# EAGLE design pms (EAGLE 9.6.2)
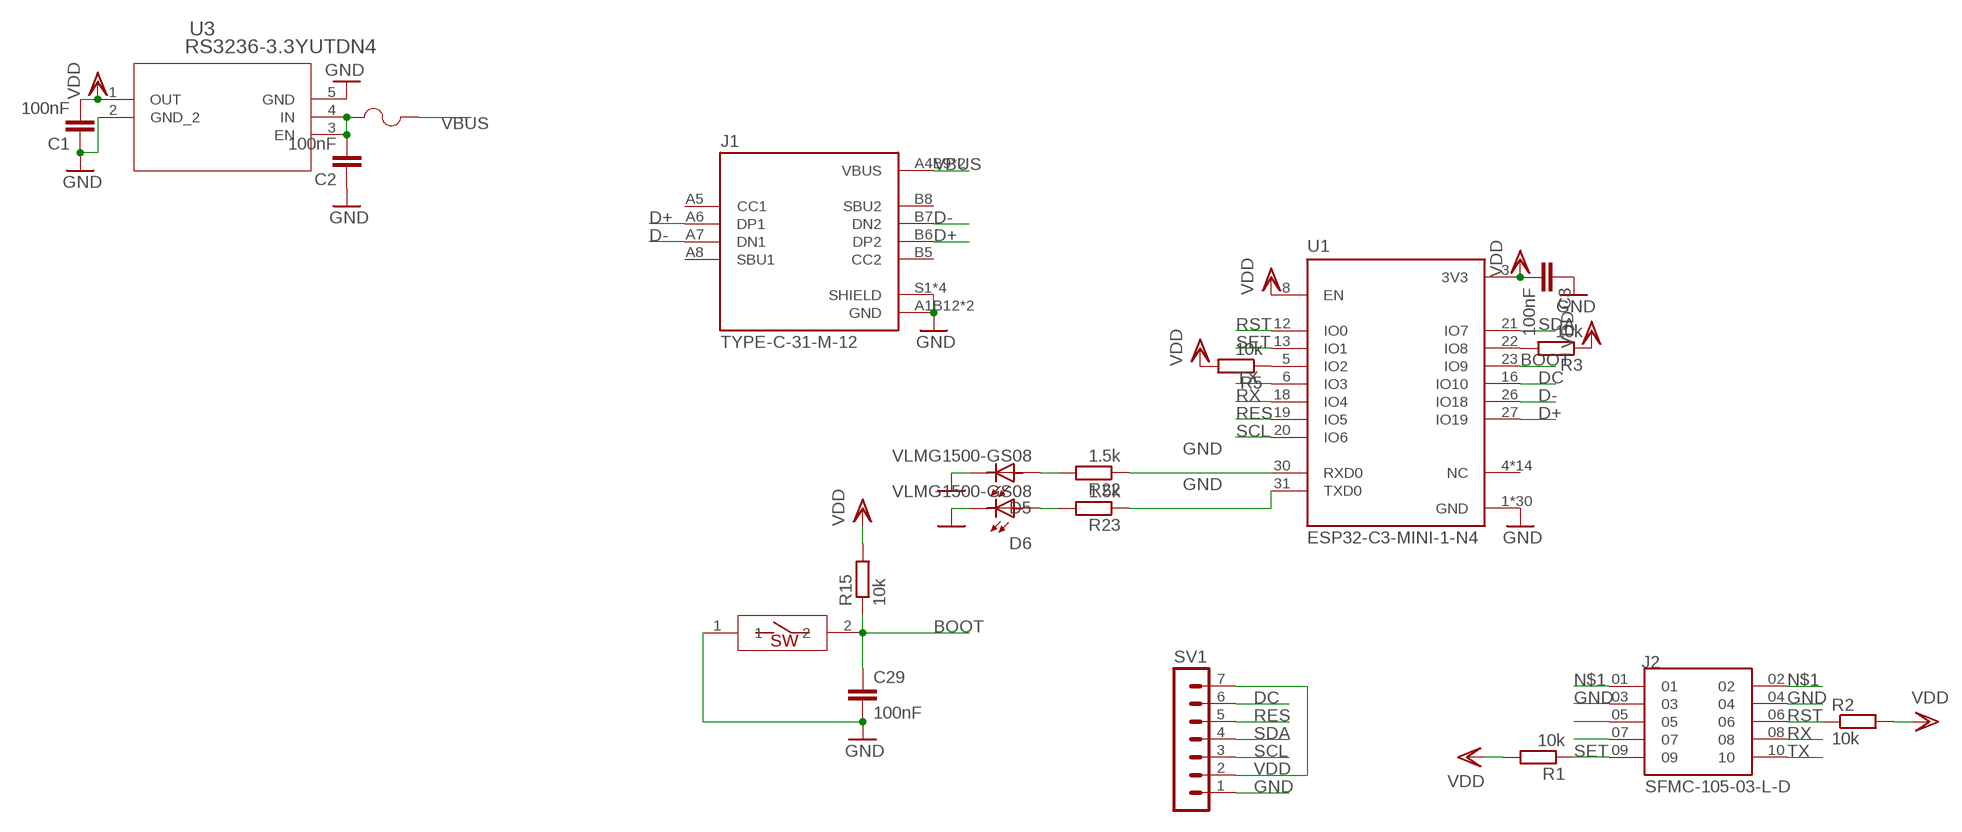
[diagram p0: schematic, sheet 1]

## Parts
C1  100nF  CC0402  [C0402]
C2  100nF  CC0402  [C0402]
C3  100nF  CC0402  [C0402]
C29  100nF  CC0402  [C0402]
D5  VLMG1500-GS08  [LEDC1005X35N]
D6  VLMG1500-GS08  [LEDC1005X35N]
F2  1210L050YR1210LSERIES_LTF-L  [1210LSERIES_LTF-L]
J1  TYPE-C-31-M-12  [HRO_TYPE-C-31-M-12]
J2  SFMC-105-03-L-D  [SAMTEC_SFMC-105-03-L-D]
R1  10k  RR0402  [R0402]
R2  10k  RR0402  [R0402]
R3  10k  RR0402  [R0402]
R5  10k  RR0402  [R0402]
R15  10k  RR0402  [R0402]
R22  1.5k  RR0402  [R0402]
R23  1.5k  RR0402  [R0402]
RESET  SMDSWITCH  [RESC4217X170]
SV1  MA07-1  [MA07-1]
U1  ESP32-C3-MINI-1-N4  [XCVR_ESP32-C3-MINI-1-N4]
U3  RS3236-3.3YUTDN4  [UTDFN-1X1-4_JRT]

## Nets
BOOT: C29.1 R15.1 RESET.2 U1.23(IO9)
D+: J1.A6(DP1) J1.B6(DP2) U1.27(IO19)
D-: J1.A7(DN1) J1.B7(DN2) U1.26(IO18)
DC: SV1.6 U1.16(IO10)
GND: C1.1 C2.1 C3.1 C29.2 D5.2 D6.2 J1.A1B12(GND) J1.B1A12(GND) J1.S1(SHIELD) J1.S2(SHIELD) J1.S3(SHIELD) J1.S4(SHIELD) J2.03 J2.04 RESET.1 SV1.1 U1.1(GND) U1.2(GND) U1.11(GND) U1.14(GND) U1.36(GND) U1.37(GND) U1.38(GND) U1.39(GND) U1.40(GND) U1.41(GND) U1.42(GND) U1.43(GND) U1.44(GND) U1.45(GND) U1.46(GND) U1.47(GND) U1.48(GND) U1.49_1(GND) U1.49_2(GND) U1.49_3(GND) U1.49_4(GND) U1.49_5(GND) U1.49_6(GND) U1.49_7(GND) U1.49_8(GND) U1.49_9(GND) U1.50(GND) U1.51(GND) U1.52(GND) U1.53(GND) U3.2(GND_2) U3.5(GND)
N$1: C2.2 F2.2 J2.01 J2.02 U3.3(EN) U3.4(IN)
N$2: R3.2 U1.22(IO8)
N$3: R5.1 U1.5(IO2)
N$4: R23.1 U1.31(TXD0)
N$5: J2.07
N$6: J2.05
N$7: R22.1 U1.30(RXD0)
N$21: D5.1 R22.2
N$25: D6.1 R23.2
RES: SV1.5 U1.19(IO5)
RST: J2.06 R2.1 U1.12(IO0)
RX: J2.08 U1.18(IO4)
SCL: SV1.3 U1.20(IO6)
SDA: SV1.4 U1.21(IO7)
SET: J2.09 R1.1 U1.13(IO1)
TX: J2.10 U1.6(IO3)
VBUS: F2.1 J1.A4B9(VBUS) J1.B4A9(VBUS)
VDD: C1.2 C3.2 R1.2 R2.2 R3.1 R5.2 R15.2 SV1.2 SV1.7 U1.3(3V3) U1.8(EN) U3.1(OUT)
Unconnected: J1.A5(CC1) J1.A8(SBU1) J1.B5(CC2) J1.B8(SBU2) U1.4(NC) U1.7(NC) U1.9(NC) U1.10(NC) U1.15(NC) U1.17(NC) U1.24(NC) U1.25(NC) U1.28(NC) U1.29(NC) U1.32(NC) U1.33(NC) U1.34(NC) U1.35(NC)

## Library data of the parts
C1-C3 C29 = eagle-ltspice:C: CAPACITOR, European symbol; SPICEMODEL: NONE; SPICEPREFIX: C
D5 D6 = VLMG1500-GS08:VLMG1500-GS08: 0402 GREEN 571nm 35MCD 65° Rectangle with Flat Top SMT LED; AVAILABILITY: Unavailable; DESCRIPTION: 0402 GREEN 571nm 35MCD 65° Rectangle with Flat Top SMT LED; MF: Vishay; MP: VLMG1500-GS08; PACKAGE: 0402 Vishay; PRICE: None
F2 = 1210 FUSE:1210L050YR; BUILT_BY: EMA_UL_Team; MANUFACTURER_PART_NUMBER: 1210L050YR; SOURCELIBRARY: LittleFuse_2015-04-13; VENDOR: Littelfuse Inc
J1 = TYPE-C-31-M-12:TYPE-C-31-M-12: USB Connectors 24 Receptacle 1 8.94*7.3mm RoHS Check prices <https://pricing.snapeda.com/parts/TYPE-C-31-M-12/HRO%20Electronics%20Co.%2C%20Ltd./view-part?ref=eda>; AVAILABILITY: Not in stock; DESCRIPTION: USB Connectors 24 Receptacle 1 8.94*7.3mm RoHS; MF: HRO Electronics Co., Ltd.; MP: TYPE-C-31-M-12; PACKAGE: Package; PRICE: None
J2 = SFMC-105-03-L-D:SFMC-105-03-L-D: Check availability <https://pricing.snapeda.com/parts/SFMC-105-03-L-D/Samtec/view-part?ref=eda>; AVAILABILITY: In Stock; DESCRIPTION: Conn Socket Strip SKT 10 POS 1.27mm Solder ST Thru-Hole Tube; MF: Samtec; MP: SFMC-105-03-L-D; PACKAGE: None; PRICE: None; PURCHASE-URL: https://pricing.snapeda.com/search/part/SFMC-105-03-L-D/?ref=eda
R1-R3 R5 R15 R22 R23 = eagle-ltspice:R: RESISTOR, European symbol; SPICEMODEL: NONE; SPICEPREFIX: R
RESET = SMD SWITCH:SMDSWITCH
SV1 = con-lstb:MA07-1: PIN HEADER; OC_FARNELL: unknown; OC_NEWARK: unknown
U1 = ESP32-C3-MINI-1-N4:ESP32-C3-MINI-1-N4: Check availability <https://pricing.snapeda.com/parts/ESP32-C3-MINI-1-N4/Espressif%20Systems/view-part?ref=eda>; AVAILABILITY: In Stock; DESCRIPTION: Bluetooth, WiFi 802.11b/g/n, Bluetooth v5.0 Transceiver Module 2.412GHz ~ 2.484GHz PCB Trace Surface Mount; MF: Espressif Systems; MP: ESP32-C3-MINI-1-N4; PACKAGE: SMD-53 Espressif Systems; PRICE: None; PURCHASE-URL: https://pricing.snapeda.com/search/part/ESP32-C3-MINI-1-N4/?ref=eda
U3 = RS3236:RS3236-3.3YUTDN4; COPYRIGHT: Copyright (C) 2022 Ultra Librarian. All rights reserved.; MANUFACTURER_PART_NUMBER: RS3236-3.3YUTDN4; MFR_NAME: RUNIC Technology

## Net classes
2 NCLS3V7: width 0.178 mm, drill 0.178 mm, clearance 0.178 mm

## Board
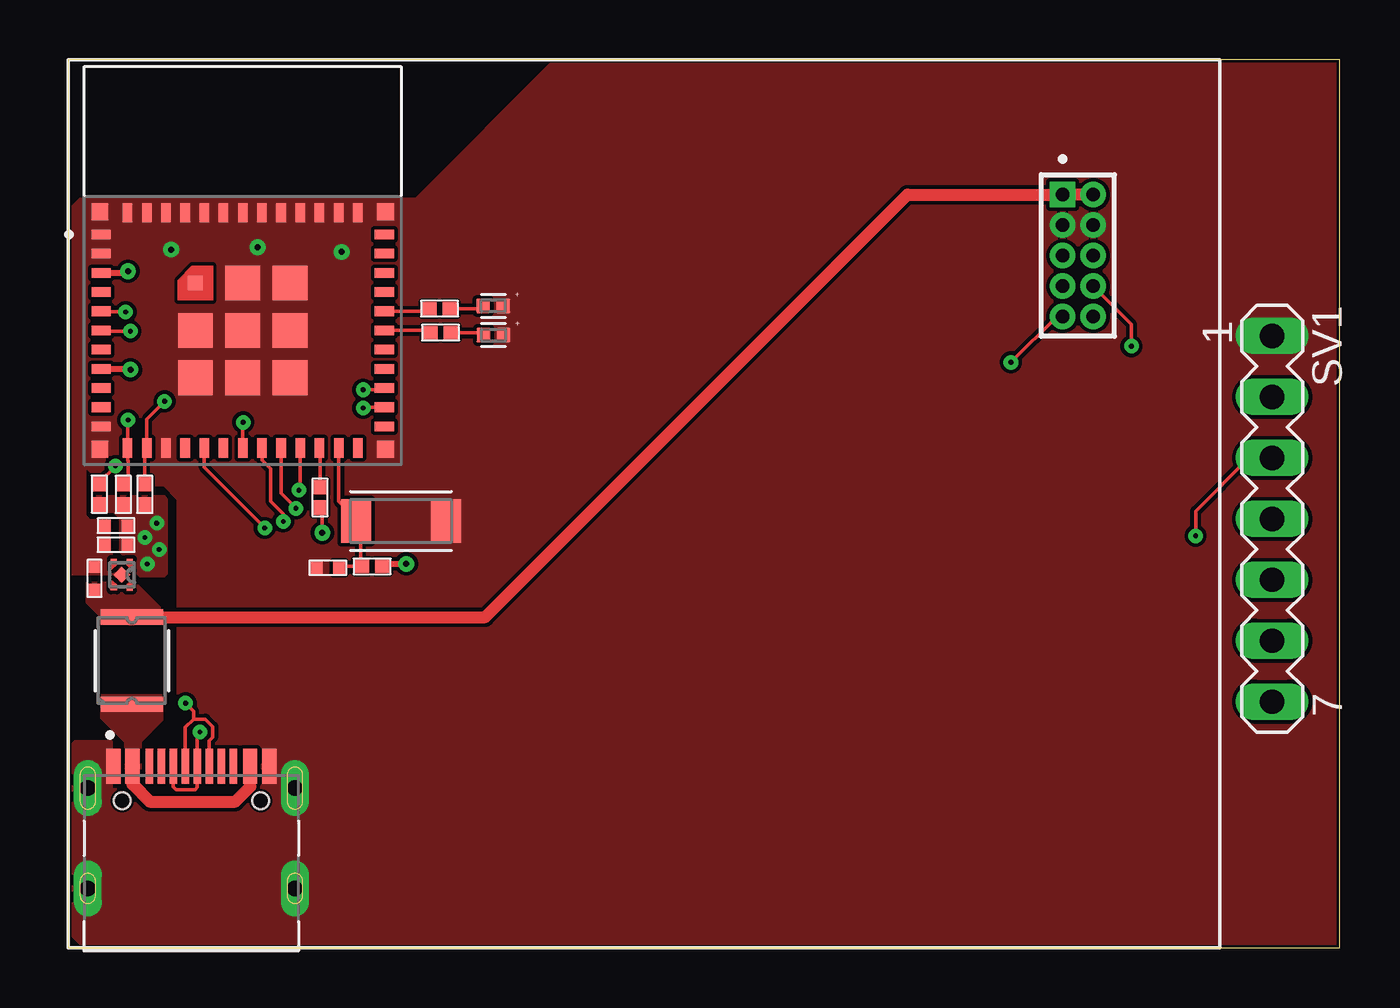
[diagram p1: board, top side]
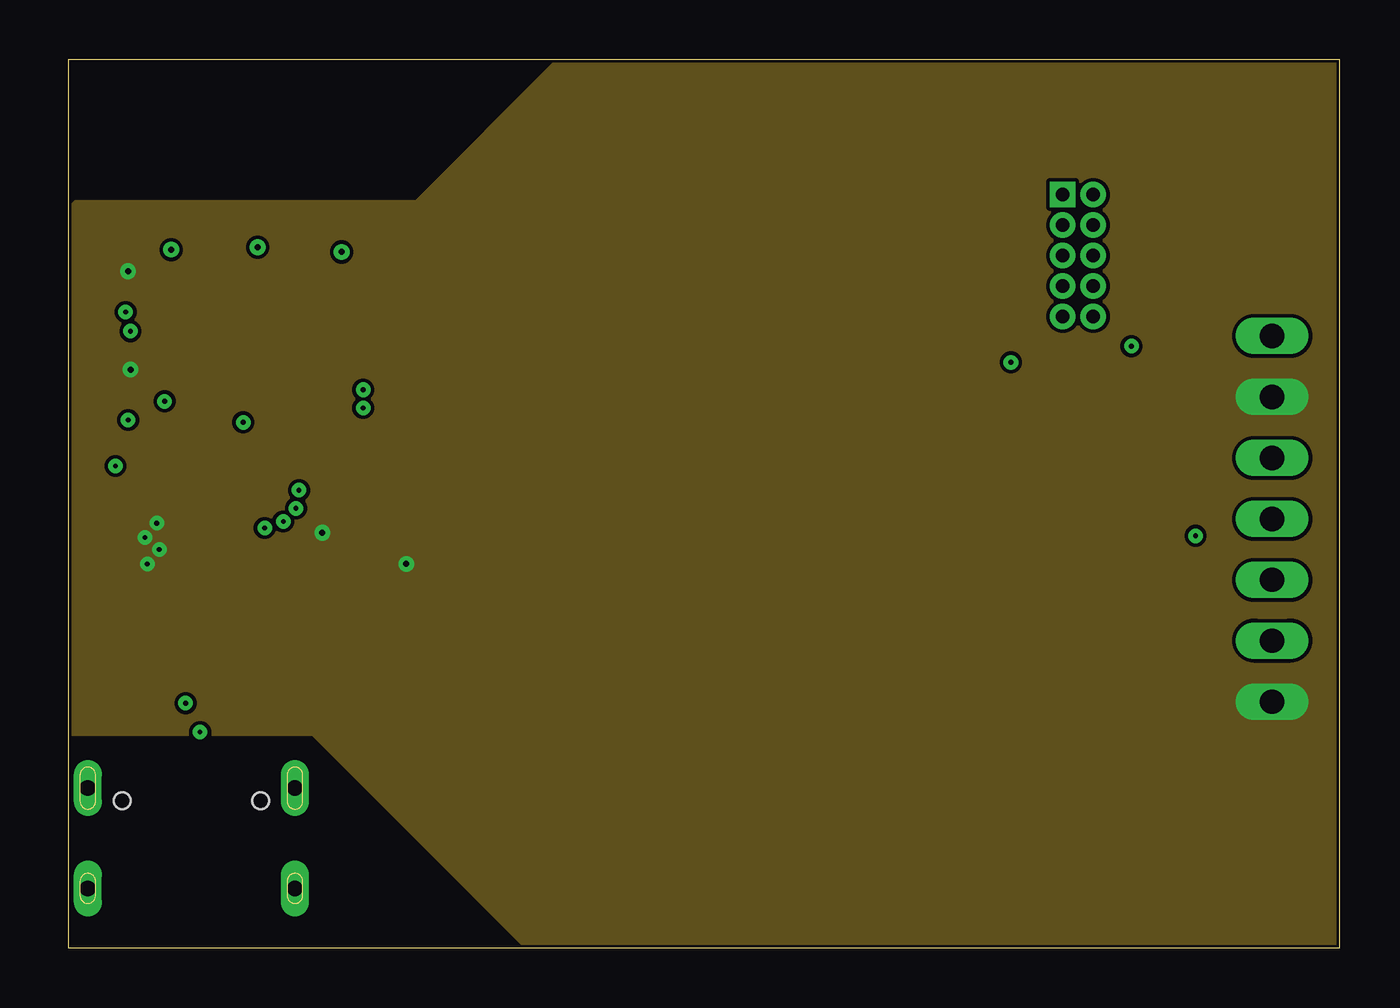
[diagram p2: board, inner layer Route15]
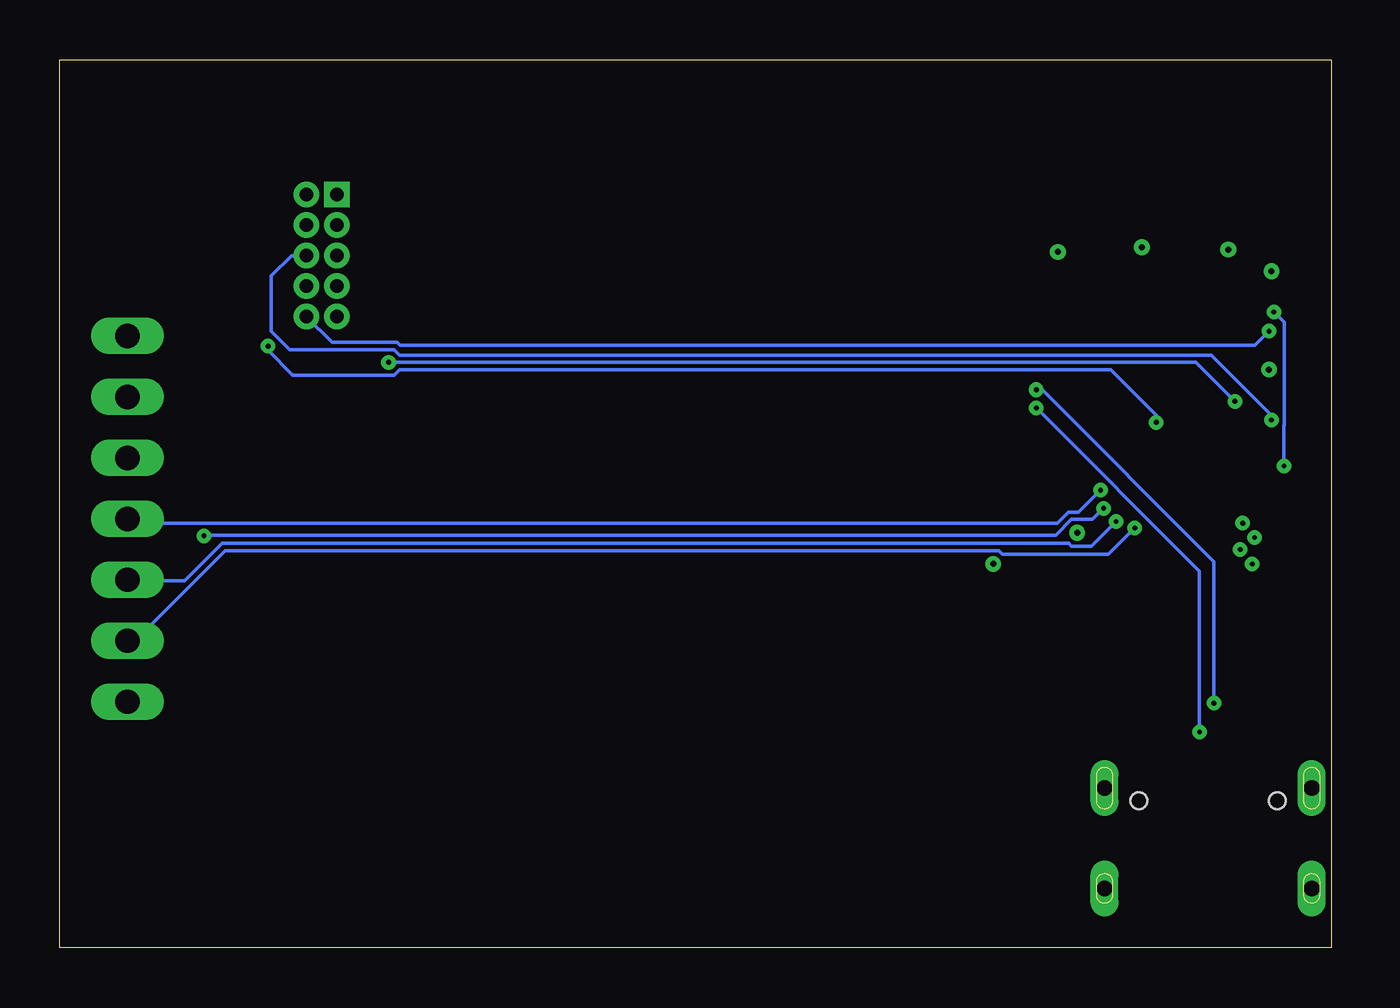
[diagram p3: board, bottom side, seen from below]

Size 53 x 37 mm. Coordinates in mm from the lower left corner, seen from the top.
Outline: 0,0 53,0 53,37 0,37 0,0
Copper layers (1+2*15+16): Top 0.035mm / dielectric 1.5mm / Route2 0.035mm / dielectric 0.15mm / Route15 0.035mm / dielectric 0.2mm / Bottom 0.035mm
Design rules "default *": minimum track width 5mil, minimum drill 0.2mm, track to track 6mil, track to pad 6mil, pad to pad 6mil, via to via 6mil, smd to smd 6mil, copper to edge 5mil, drill to drill 6mil, minimum pad ring 10mil, minimum via ring 8mil, stop-mask expansion 0mil, vias tented up to drill 40mil, thermal gap 0mil

### Footprints (pad centres in the part's own frame; a part is rotated, then mirrored left to right if it is on the bottom)
C0402 = smd 0.5 x 0.5: 1 -0.475,0; 2 0.475,0
LEDC1005X35N = smd 0.59 x 0.61: 1 -0.415,0; 2 0.415,0
1210LSERIES_LTF-L = smd 0.635 x 2.591: 1 -1.816,0; 2 1.816,0
HRO_TYPE-C-31-M-12 = smd 0.6 x 1.45: A1B12 -3.25,5.095; A4B9 -2.45,5.095; B1A12 3.25,5.095; B4A9 2.45,5.095 | smd 0.3 x 1.45: A5 -1.25,5.095; A6 -0.25,5.095; A7 0.25,5.095; A8 1.25,5.095; B5 1.75,5.095; B6 0.75,5.095; B7 -0.75,5.095; B8 -1.75,5.095 | drill 0.65 pad 1.05 long: S1 -4.32,4.18; S2 4.32,4.18; S3 -4.32,0; S4 4.32,0 | hole 0.7: -2.89,3.65; 2.89,3.65
SAMTEC_SFMC-105-03-L-D = drill 0.559 pad 0.889 square: 01 0,0 | drill 0.559 pad 0.889: 02 0,1.27; 03 1.27,0; 04 1.27,1.27; 05 2.54,0; 06 2.54,1.27; 07 3.81,0; 08 3.81,1.27; 09 5.08,0; 10 5.08,1.27
R0402 = smd 0.6 x 0.55: 1 -0.425,0; 2 0.425,0
RESC4217X170 = smd 1.254 x 1.829: 1 -1.875,0; 2 1.875,0
MA07-1 = drill 1.016 long: 1 -7.62,0; 2 -5.08,0; 3 -2.54,0; 4 0,0; 5 2.54,0; 6 5.08,0; 7 7.62,0
XCVR_ESP32-C3-MINI-1-N4 = smd 0.8 x 0.4: 1 -5.9,1.3; 2 -5.9,0.5; 3 -5.9,-0.3; 4 -5.9,-1.1; 5 -5.9,-1.9; 6 -5.9,-2.7; 7 -5.9,-3.5; 8 -5.9,-4.3; 9 -5.9,-5.1; 10 -5.9,-5.9; 11 -5.9,-6.7; 25 5.9,-6.7; 26 5.9,-5.9; 27 5.9,-5.1; 28 5.9,-4.3; 29 5.9,-3.5; 30 5.9,-2.7; 31 5.9,-1.9; 32 5.9,-1.1; 33 5.9,-0.3; 34 5.9,0.5; 35 5.9,1.3 | smd 0.4 x 0.8: 12 -4.8,-7.6; 13 -4,-7.6; 14 -3.2,-7.6; 15 -2.4,-7.6; 16 -1.6,-7.6; 17 -0.8,-7.6; 18 0,-7.6; 19 0.8,-7.6; 20 1.6,-7.6; 21 2.4,-7.6; 22 3.2,-7.6; 23 4,-7.6; 24 4.8,-7.6; 36 4.8,2.2; 37 4,2.2; 38 3.2,2.2; 39 2.4,2.2; 40 1.6,2.2; 41 0.8,2.2; 42 0,2.2; 43 -0.8,2.2; 44 -1.6,2.2; 45 -2.4,2.2; 46 -3.2,2.2; 47 -4,2.2; 48 -4.8,2.2 | smd 0.6 x 0.6: 49_1 -1.975,-0.725 | smd 1.45 x 1.45: 49_2 0,-0.725; 49_3 1.975,-0.725; 49_4 1.975,-2.7; 49_5 1.975,-4.675; 49_6 0,-4.675; 49_7 -1.975,-4.675; 49_8 -1.975,-2.7; 49_9 0,-2.7 | smd 0.7 x 0.7: 50 5.95,2.25; 51 5.95,-7.65; 52 -5.95,-7.65; 53 -5.95,2.25
UTDFN-1X1-4_JRT = smd 0.229 x 0.254: 1 -0.54,0.33; 2 -0.54,-0.33; 3 0.54,-0.33; 4 0.54,0.33 | smd 0.483 x 0.483 rotated 45: 5 0,0

### Placement (x,y rotation side)
C1  2,17.6 0 top
C2  1.1,15.4 270 top
C3  2,16.8 0 top
C29  10.83,15.84 180 top
D5  17.73,25.54 0 top
D6  17.72,26.75 0 top
F2  2.66,11.97 90 top
J1  5.14,2.48 0 top
J2  41.46,31.39 270 top
R1  3.2,18.9 270 top
R2  2.3,18.9 270 top
R3  10.5,18.77 90 top
R5  1.3,18.91 270 top
R15  12.67,15.9 0 top
R22  15.53,25.64 0 top
R23  15.49,26.64 0 top
RESET  13.88,17.79 180 top
SV1  50.19,17.88 270 top
U1  7.28,28.43 0 top
U3  2.24,15.55 270 top

### Tracks (layer width: path | path; a pad name or v marks a point on that pad's centre or on a via)
BOOT
  Top 0.15: U1.23 11.28,18.62 11.95,17.95 12.01,17.89 | 12.01,17.89 RESET.2 | C29.1 11.37,15.9 R15.1 12.2,15.95 12.2,17.7 12.01,17.89
D+  (via drill 0.2)
  Top 0.15: J1.A6 4.89,9.19 5.23,9.53 | 5.23,9.53 5.72,9.53 6.03,9.22 6.03,8.78 5.89,8.64 J1.B6 | 5.23,9.53 5.23,9.87 v4.9,10.2 | v12.3,23.26 13.11,23.26 U1.27
  Bottom 0.15: v4.9,10.2 4.9,16.1 12.06,23.26 v12.3,23.26
D-  (via drill 0.2)
  Top 0.15: U1.26 12.33,22.53 v12.3,22.5 | v5.5,9 5.39,8.89 J1.A7 5.39,6.69 5.3,6.6 4.5,6.6 4.39,6.71 J1.B7
  Bottom 0.15: v12.3,22.5 5.5,15.7 v5.5,9
DC  (via drill 0.2)
  Top 0.15: v8.2,17.5 5.68,20.02 U1.16
  Bottom 0.15: SV1.6 49.87,12.8 46.12,16.56 13.87,16.56 13.71,16.4 9.3,16.4 v8.2,17.5
GND  (via drill 0.25)
  other vias: 4.3,29.1 7.9,29.2 11.4,29
  pour Top: 2.2,15.3 1.9,15.6 0,15.6 0,30.7 0.5,31.2 2.6,31.2 2.6,23 0.7,21.1 0.7,18 0.9,17.8 1.7,17.8 1.7,16.6 1.8,16.5 1.8,16.2 2.4,15.6 2.2,15.4
  pour Top: 0.9,31.2 14.5,31.2 20.3,37 53,37 53,0.2 53.1,0.1 0.6,0.1 0.1,0.6 0.1,8.4 0.3,8.6 1.8,8.6 1.8,6.6 4.6,6.6 4.6,18.7 4,19.3 1.5,19.3 0.6,20.2 0.6,30.9
N$1
  Top 0.508: F2.2 17.39,13.79 34.99,31.39 J2.01 J2.02
  pour Top: 1.4,13.5 1.4,13.8 0.8,14.4 0.8,15.2 1.7,15.2 1.9,15.1 2.1,14.9 2.3,14.9 2.7,15.3 3.9,14.1 3.9,13.5
N$2
  Top 0.15: R3.2 10.5,20.81 U1.22
N$3  (via drill 0.2)
  Top 0.15: R5.1 1.3,19.41 v1.98,20.08 | v2.4,26.5 1.41,26.5 U1.5
  Bottom 0.15: v1.98,20.08 1.98,21.77 1.97,21.78 1.97,26.07 v2.4,26.5
N$4
  Top 0.15: U1.31 14.96,26.53 R23.1
N$7
  Top 0.15: U1.30 15.02,25.73 R22.1
N$21
  Top 0.15: R22.2 17.21,25.64 D5.1
N$25
  Top 0.15: R23.2 17.2,26.64 D6.1
RES  (via drill 0.2)
  Top 0.15: U1.19 8.08,20.33 8.45,19.96 8.45,18.61 8.97,18.09 v8.97,17.77
  Bottom 0.15: SV1.5 50.15,15.3 47.8,15.3 46.24,16.86 10.94,16.86 10.83,16.74 10,16.74 v8.97,17.77
RST  (via drill 0.2)
  Top 0.15: v2.5,22 2.48,21.98 U1.12 2.48,20.33 2.51,20.3 2.51,19.53 R2.1
  Bottom 0.15: v2.5,22 2.5,22.2 5,24.7 38.85,24.7 39.08,24.93 43.43,24.93 44.2,25.7 44.2,28 43.35,28.85 J2.06
RX  (via drill 0.2)
  Top 0.15: J2.08 44.33,25.98 v44.33,25.07 | v7.3,21.9 7.28,21.88 U1.18
  Bottom 0.15: v7.3,21.9 7.3,22.2 9.2,24.1 38.85,24.1 39.08,23.87 43.3,23.87 44.33,24.9 v44.33,25.07
SCL  (via drill 0.2)
  Top 0.15: U1.20 8.88,18.94 v9.5,18.32 | v47,17.17 47,18.2 49.22,20.42 SV1.3
  Bottom 0.15: v47,17.17 47,17.2 11.49,17.2 10.83,17.86 9.96,17.86 v9.5,18.32
SDA  (via drill 0.2)
  Top 0.15: U1.21 9.68,19.13 v9.62,19.07
  Bottom 0.15: SV1.4 50.52,17.88 50.7,17.7 11.41,17.7 10.96,18.16 10.54,18.16 v9.62,19.07
SET  (via drill 0.2)
  Top 0.15: R1.1 3.2,20.75 U1.13 3.28,22.03 v4.03,22.77 | v39.3,24.4 41.21,26.31 J2.09
  Bottom 0.15: v4.03,22.77 5.65,24.4 v39.3,24.4
TX  (via drill 0.2)
  Top 0.15: v2.6,25.7 1.41,25.7 U1.6
  Bottom 0.15: J2.10 41.65,25.23 38.95,25.23 38.83,25.11 3.19,25.11 v2.6,25.7
VBUS
  Top 0.508: J1.A4B9 2.69,6.81 3.4,6.1 6.97,6.1 7.59,6.72 J1.B4A9
  pour Top: 2.4,7 2.4,8.6 1.4,9.6 1.4,10.5 3.9,10.5 3.9,9.5 3,8.6 3,7
VDD  (via drill 0.2, 0.25)
  Top 0.15: R3.1 10.6,18.25 v10.6,17.3
  Top 0.254: U1.3 2.43,28.13 v2.5,28.2 | U1.8 2.57,24.13 v2.6,24.1 | R15.2 13.2,16 v14.1,16
  other vias: 3.3,16 3.8,16.6 3.2,17.1 3.7,17.7
  pour Top: 2.5,16 2.5,16.2 2.2,16.5 2.2,17.9 1.9,18.2 1.1,18.2 1.1,18.8 4,18.8 4.1,18.7 4.1,15.6 4,15.5 3,15.5
  pour Route15: 0.3,31.1 14.5,31.1 20.3,36.9 53,36.9 53,0 19.1,0 10.2,8.9 0,8.9 0,30.8